# Altium project roneMotorBoard-v12.PrjPcb
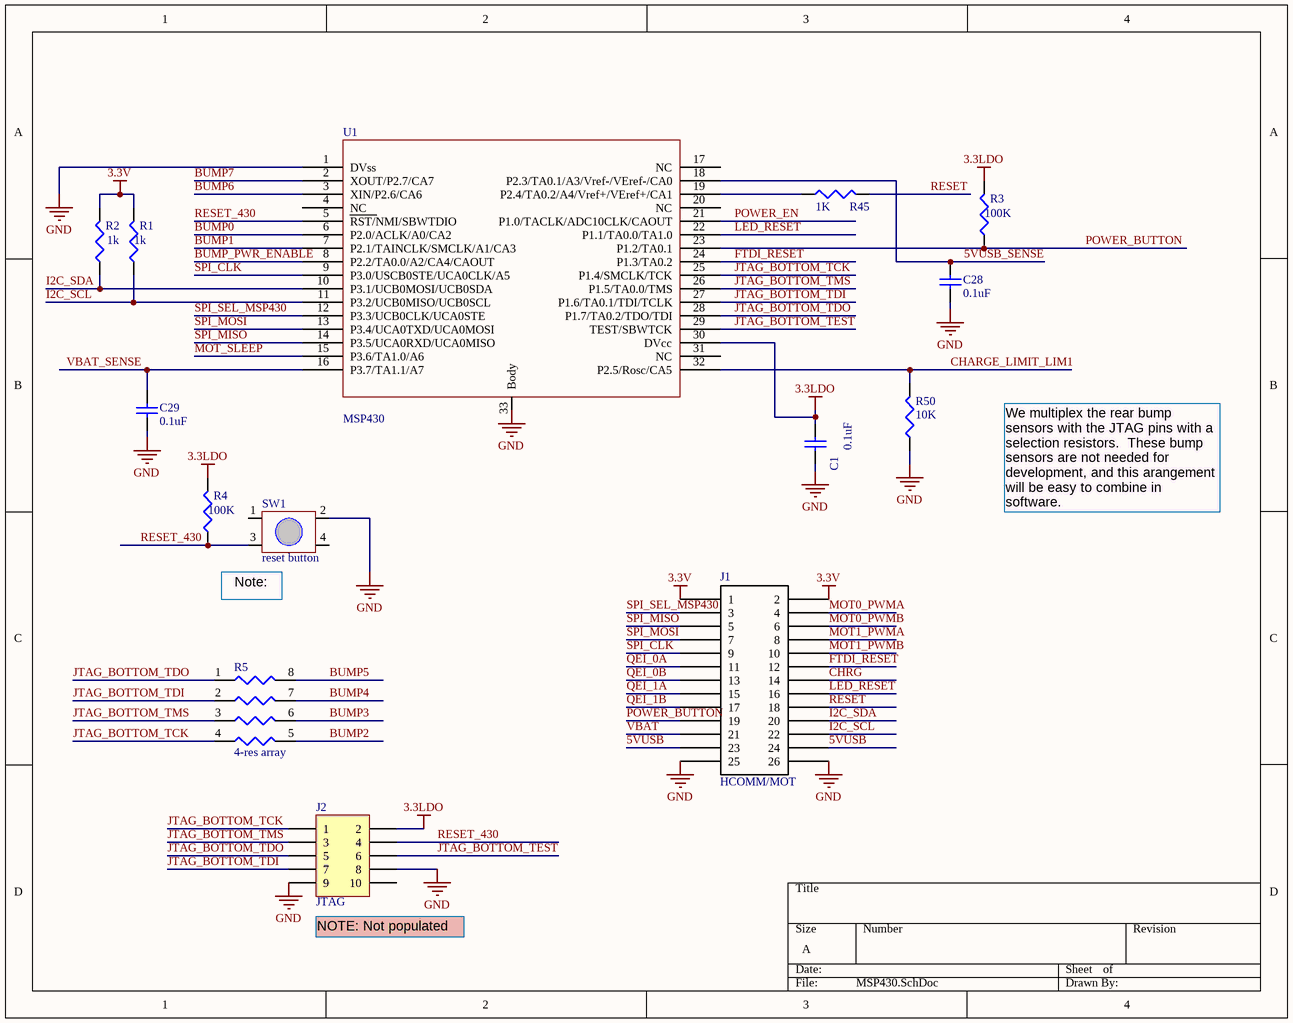
[diagram p0: MSP430.SchDoc]
2 sheets, 41 parts. Net scope: global (net labels, ports and power ports of the same name join across sheets).
Board file: roneMotorBoard-v12.PcbDoc
Sheets:
  MSP430.SchDoc
  Power.SchDoc

## Sheet MSP430.SchDoc
size A; SheetNumber: roneV11-msp430; SheetTotal: 6

### Parts
C1  value 0.1uF  [CAPC1005L]  (hidden comment: Cap Semi)
C28  value 0.1uF  [CAPC1005L]  (hidden comment: Cap Semi)
C29  value 0.1uF  [CAPC1005L]  (hidden comment: Cap Semi)
J1  HCOMM/MOT  [HeaderSM 13x2]
J2  JTAG  [HDR2X5]
R1  value 1k  [RESC1608L]  (hidden comment: Res3)
R2  value 1k  [RESC1608L]  (hidden comment: Res3)
R3  value 100K  [RESC1608L]  (hidden comment: Res3)
R4  value 100K  [RESC1608L]  (hidden comment: Res3)
R5  4-res array  [4-RES ARRAY]
R45  value 1K  [J1-0603]
R50  value 10K  [RESC1608L]  (hidden comment: Res3)
SW1  reset button  [SwitchTall-TL330]
U1  MSP430  [MSP430_32PIN]

### Nets
3.3LDO: C1.2 J2.2 R3.2 R4.2 U1.30(DVcc)
3.3V: J1.1 J1.2 R1.2 R2.2
5VUSB: J1.23 J1.24
GND: C1.1 C28.1 C29.1 J1.25 J1.26 J2.8 J2.9 R50.1 SW1.2 U1.1(DVss) U1.33(Body)
VBAT: J1.21
5VUSB_SENSE: C28.2 U1.18(P2.3/TA0.1/A3/Vref-/VEref-/CA0)
BUMP0: U1.6(P2.0/ACLK/A0/CA2)
BUMP1: U1.7(P2.1/TAINCLK/SMCLK/A1/CA3)
BUMP2: R5.5
BUMP3: R5.6
BUMP4: R5.7
BUMP5: R5.8
BUMP6: U1.3(XIN/P2.6/CA6)
BUMP7: U1.2(XOUT/P2.7/CA7)
BUMP_PWR_ENABLE: U1.8(P2.2/TA0.0/A2/CA4/CAOUT)
CHARGE_LIMIT_LIM1: R50.2 U1.32(P2.5/Rosc/CA5)
CHRG: J1.14
FTDI_RESET: J1.12 U1.24(P1.3/TA0.2)
I2C_SCL: J1.22 R1.1 U1.11(P3.2/UCB0MISO/UCB0SCL)
I2C_SDA: J1.20 R2.1 U1.10(P3.1/UCB0MOSI/UCB0SDA)
JTAG_BOTTOM_TCK: J2.1 R5.4 U1.25(P1.4/SMCLK/TCK)
JTAG_BOTTOM_TDI: J2.7 R5.2 U1.27(P1.6/TA0.1/TDI/TCLK)
JTAG_BOTTOM_TDO: J2.5 R5.1 U1.28(P1.7/TA0.2/TDO/TDI)
JTAG_BOTTOM_TEST: J2.6 U1.29(TEST/SBWTCK)
JTAG_BOTTOM_TMS: J2.3 R5.3 U1.26(P1.5/TA0.0/TMS)
LED_RESET: J1.16 U1.22(P1.1/TA0.0/TA1.0)
MOT0_PWMA: J1.4
MOT0_PWMB: J1.6
MOT1_PWMA: J1.8
MOT1_PWMB: J1.10
MOT_SLEEP: U1.15(P3.6/TA1.0/A6)
POWER_BUTTON: J1.19 R3.1 U1.23(P1.2/TA0.1)
POWER_EN: U1.21(P1.0/TACLK/ADC10CLK/CAOUT)
QEI_0A: J1.11
QEI_0B: J1.13
QEI_1A: J1.15
QEI_1B: J1.17
RESET: J1.18 R45.2
RESET_430: J2.4 R4.1 SW1.3 U1.5(RST/NMI/SBWTDIO)
SPI_CLK: J1.9 U1.9(P3.0/USCB0STE/UCA0CLK/A5)
SPI_MISO: J1.5 U1.14(P3.5/UCA0RXD/UCA0MISO)
SPI_MOSI: J1.7 U1.13(P3.4/UCA0TXD/UCA0MOSI)
SPI_SEL_MSP430: J1.3 U1.12(P3.3/UCB0CLK/UCA0STE)
VBAT_SENSE: C29.2 U1.16(P3.7/TA1.1/A7)
NetR45_1: R45.1 U1.19(P2.4/TA0.2/A4/Vref+/VEref+/CA1)

Not connected (* = marked no-connect by the designer): J2 10; SW1 1 4; U1 4(NC) 17(NC) 20(NC) 31(NC)

### Notes on the sheet
- We multiplex the rear bump sensors with the JTAG pins with a selection resistors.  These bump sensors are not needed for development, and this arangement will be easy to combine in software.
- Note: DNP
- (near J2) NOTE: Not populated

### Library data of the parts
C1 C28 C29 = Cap Semi: Capacitor (Semiconductor SIM Model); Published: 8-Jun-2000; LatestRevisionDate: 29-May-2009; LatestRevisionNote: IPC-7351 Footprint Added.; PackageReference: C1206; Publisher: Altium Limited; PackageDescription: Chip Capacitor
J1 = HCOMM/HMOT: Header, 2X20, 50mil, IDC
J2 = Header 5X2: Header, 5-Pin, Dual row; LatestRevisionDate: 17-Jul-2002; LatestRevisionNote: Re-released for DXP Platform.; Publisher: Altium Limited
R1-R4 R45 R50 = Res3: Resistor; Published: 8-Jun-2000; LatestRevisionDate: 29-May-2009; LatestRevisionNote: IPC-7351 Footprint Added.; PackageReference: J1-0603; Publisher: Altium Limited; PackageDescription: Chip Resistor
R5 = 4 Res Array
SW1 = Switch-TL330
U1 = MSP430_32pin

## Sheet Power.SchDoc
size A; SheetNumber: roneV11-Power; SheetTotal: 6
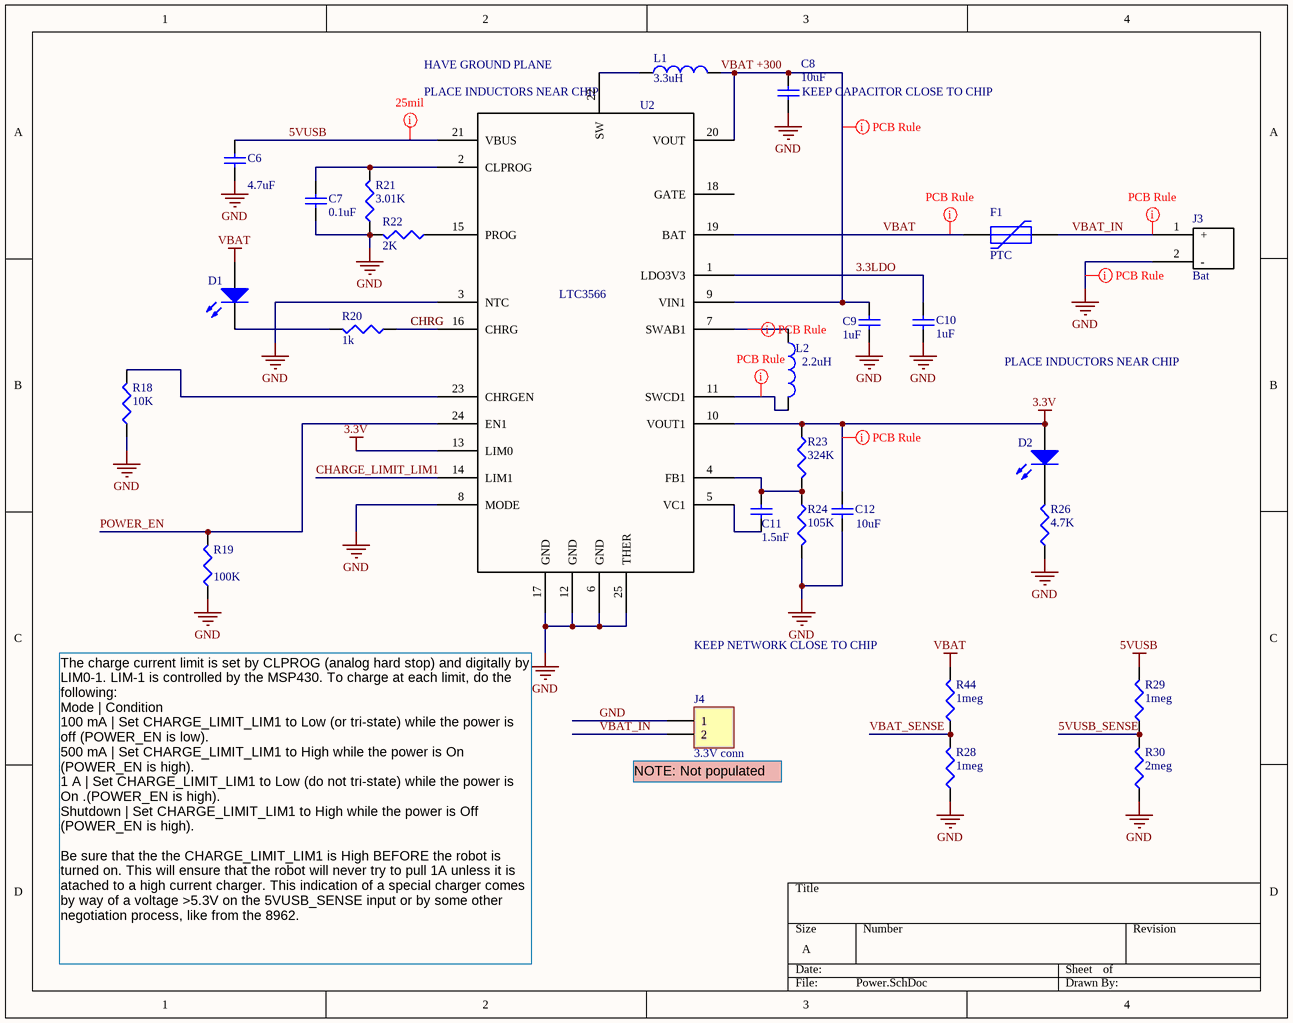
[diagram p1: Power.SchDoc]

### Parts
C6  value 4.7uF  [CAPC1608L]  (hidden comment: Cap Semi)
C7  value 0.1uF  [CAPC1005L]  (hidden comment: Cap)
C8  value 10uF  [CAPC1608L]  (hidden comment: Cap)
C9  value 1uF  [CAPC1608L]  (hidden comment: Cap)
C10  value 1uF  [CAPC1608L]  (hidden comment: Cap)
C11  value 1.5nF  [CAPC1005L]  (hidden comment: Cap)
C12  value 10uF  [CAPC1608L]  (hidden comment: Cap)
D1  Charge  [INDC2012L]  (value not drawn)
D2  Power  [INDC2012L]  (value not drawn)
F1  PTC  [ERJ8G-1206]
J3  Bat  [BatteryConnJST]
J4  3.3V conn  [HDR1X2]
L1  3.3uH  [IndPow]
L2  2.2uH  [IndPow]
R18  value 10K  [RESC1608L]  (hidden comment: Res3)
R19  value 100K  [RESC1608L]  (hidden comment: Res3)
R20  value 1k  [RESC1608L]  (hidden comment: Res3)
R21  value 3.01K  [RESC1608L]  (hidden comment: Res3)
R22  value 2K  [RESC1608L]  (hidden comment: Res3)
R23  value 324K  [RESC1608L]  (hidden comment: Res3)
R24  value 105K  [RESC1608L]  (hidden comment: Res3)
R26  value 4.7K  [RESC1608L]  (hidden comment: Res3)
R28  value 1meg  [RESC1608L]  (hidden comment: Res3)
R29  value 1meg  [RESC1608L]  (hidden comment: Res3)
R30  value 2meg  [RESC1608L]  (hidden comment: Res3)
R44  value 1meg  [RESC1608L]  (hidden comment: Res3)
U2  LTC3566  [QFN-24]

### Nets
3.3LDO: C10.1 U2.1(LDO3V3)
3.3V: C12.2 D2.1(A) R23.1 U2.10(VOUT1) U2.13(LIM0)
5VUSB: C6.2 R29.2 U2.21(VBUS)
GND: C6.1 C7.1 C8.1 C9.2 C10.2 C12.1 J3.2(-) J4.1 R18.1 R19.1 R21.1 R22.2 R24.2 R26.1 R28.1 R30.1 U2.3(NTC) U2.6(GND) U2.8(MODE) U2.12(GND) U2.17(GND) U2.25(THER)
VBAT: D1.1(A) F1.1 R44.2 U2.19(BAT)
5VUSB_SENSE: R29.1 R30.2
CHARGE_LIMIT_LIM1: U2.14(LIM1)
CHRG: R20.1 U2.16(CHRG)
POWER_EN: R19.2 U2.24(EN1)
VBAT +300: C8.2 C9.1 L1.2 U2.9(VIN1) U2.20(VOUT)
VBAT_IN: F1.2 J3.1(+) J4.2
VBAT_SENSE: R28.2 R44.1
NetC7_2: C7.2 R21.2 U2.2(CLPROG)
NetC11_1: C11.1 R23.2 R24.1 U2.4(FB1)
NetC11_2: C11.2 U2.5(VC1)
NetD1_2: D1.2(K) R20.2
NetD2_2: D2.2(K) R26.2
NetL1_1: L1.1 U2.22(SW)
NetL2_1: L2.1 U2.7(SWAB1)
NetL2_2: L2.2 U2.11(SWCD1)
NetR18_2: R18.2 U2.23(CHRGEN)
NetR22_1: R22.1 U2.15(PROG)

Not connected (* = marked no-connect by the designer): U2 18(GATE)

### Layout directives
rule Width Constraint [Pref Width = 25mil    Min Width = 10mil    Max Width = 25mil]: 5VUSB, GND, NetL2_1, NetL2_2, VBAT +300, VBAT_IN
rule Width Constraint [Pref Width = 25mil    Min Width = 10mil    Max Width = 100mil]: 3.3V
rule Width Constraint [Pref Width = 25mil    Min Width = 10mil    Max Width = 50mil]: VBAT

### Notes on the sheet
- (near U2) HAVE GROUND PLANE
- (near U2) PLACE INDUCTORS NEAR CHIP
- (near C8) KEEP CAPACITOR CLOSE TO CHIP
- CHRG
- PLACE INDUCTORS NEAR CHIP
- KEEP NETWORK CLOSE TO CHIP
- (near J4) NOTE: Not populated
- The charge current limit is set by CLPROG (analog hard stop) and digitally by LIM0-1. LIM-1 is controlled by the MSP430. To charge at each limit, do the following:
  Mode	| Condition
  100 mA	| Set CHARGE_LIMIT_LIM1 to Low (or tri-state) while the power is off (POWER_EN is low).
  500 mA	| Set CHARGE_LIMIT_LIM1 to High while the power is On (POWER_EN is high).
  1 A	| Set CHARGE_LIMIT_LIM1 to Low (do not tri-state) while the power is On .(POWER_EN is high).
  Shutdown | Set CHARGE_LIMIT_LIM1 to High while the power is Off (POWER_EN is high).
  Be sure that the the CHARGE_LIMIT_LIM1 is High BEFORE the robot is turned on. This will ensure that the robot will never try to pull 1A unless it is atached to a high current charger. This indication of a special charger comes by way of a voltage >5.3V on the 5VUSB_SENSE input or by some other negotiation process, like from the 8962.

### Library data of the parts
C6 = Cap Semi: Capacitor (Semiconductor SIM Model); Published: 8-Jun-2000; LatestRevisionDate: 29-May-2009; LatestRevisionNote: IPC-7351 Footprint Added.; PackageReference: C1206; Publisher: Altium Limited; PackageDescription: Chip Capacitor
C7-C12 = Cap: Capacitor; Published: 8-Jun-2000; LatestRevisionDate: 17-Jul-2002; LatestRevisionNote: Re-released for DXP Platform.; PackageReference: RAD-0.3; Publisher: Altium Limited
D1 D2 = LED2: Typical RED, GREEN, YELLOW, AMBER GaAs LED; Published: 8-Jun-2000; LatestRevisionDate: 17-Jul-2002; LatestRevisionNote: Re-released for DXP Platform.; PackageVersion: Feb-2002; PackageReference: 3.2X1.6X1.1; Publisher: Altium Limited
F1 = PTC_FUSE: Fuse; Published: 8-Jun-2000; LatestRevisionDate: 17-Jul-2002; LatestRevisionNote: Re-released for DXP Platform.; PackageReference: PIN-W2/E2.8; Publisher: Altium Limited
J3 = BatteryConnJST
J4 = Header 2: Header, 2-Pin; LatestRevisionDate: 17-Jul-2002; LatestRevisionNote: Re-released for DXP Platform.; Publisher: Altium Limited
L1 L2 = Inductor
  L1: Value: 3.3uH
  L2: Value: 2.2uH
R18-R24 R26 R28-R30 R44 = Res3: Resistor; Published: 8-Jun-2000; LatestRevisionDate: 29-May-2009; LatestRevisionNote: IPC-7351 Footprint Added.; PackageReference: J1-0603; Publisher: Altium Limited; PackageDescription: Chip Resistor

## Nets that join several sheets
3.3LDO: MSP430 (5 pins), Power (C10.1 U2.1)
3.3V: MSP430 (J1.1 J1.2 R1.2 R2.2), Power (5 pins)
5VUSB: MSP430 (J1.23 J1.24), Power (C6.2 R29.2 U2.21)
GND: MSP430 (11 pins), Power (22 pins)
VBAT: MSP430 (J1.21), Power (D1.1 F1.1 R44.2 U2.19)
5VUSB_SENSE: MSP430 (C28.2 U1.18), Power (R29.1 R30.2)
CHARGE_LIMIT_LIM1: MSP430 (R50.2 U1.32), Power (U2.14)
CHRG: MSP430 (J1.14), Power (R20.1 U2.16)
POWER_EN: MSP430 (U1.21), Power (R19.2 U2.24)
VBAT_SENSE: MSP430 (C29.2 U1.16), Power (R28.2 R44.1)